# Altium project Arduino_Nano.PrjPcb
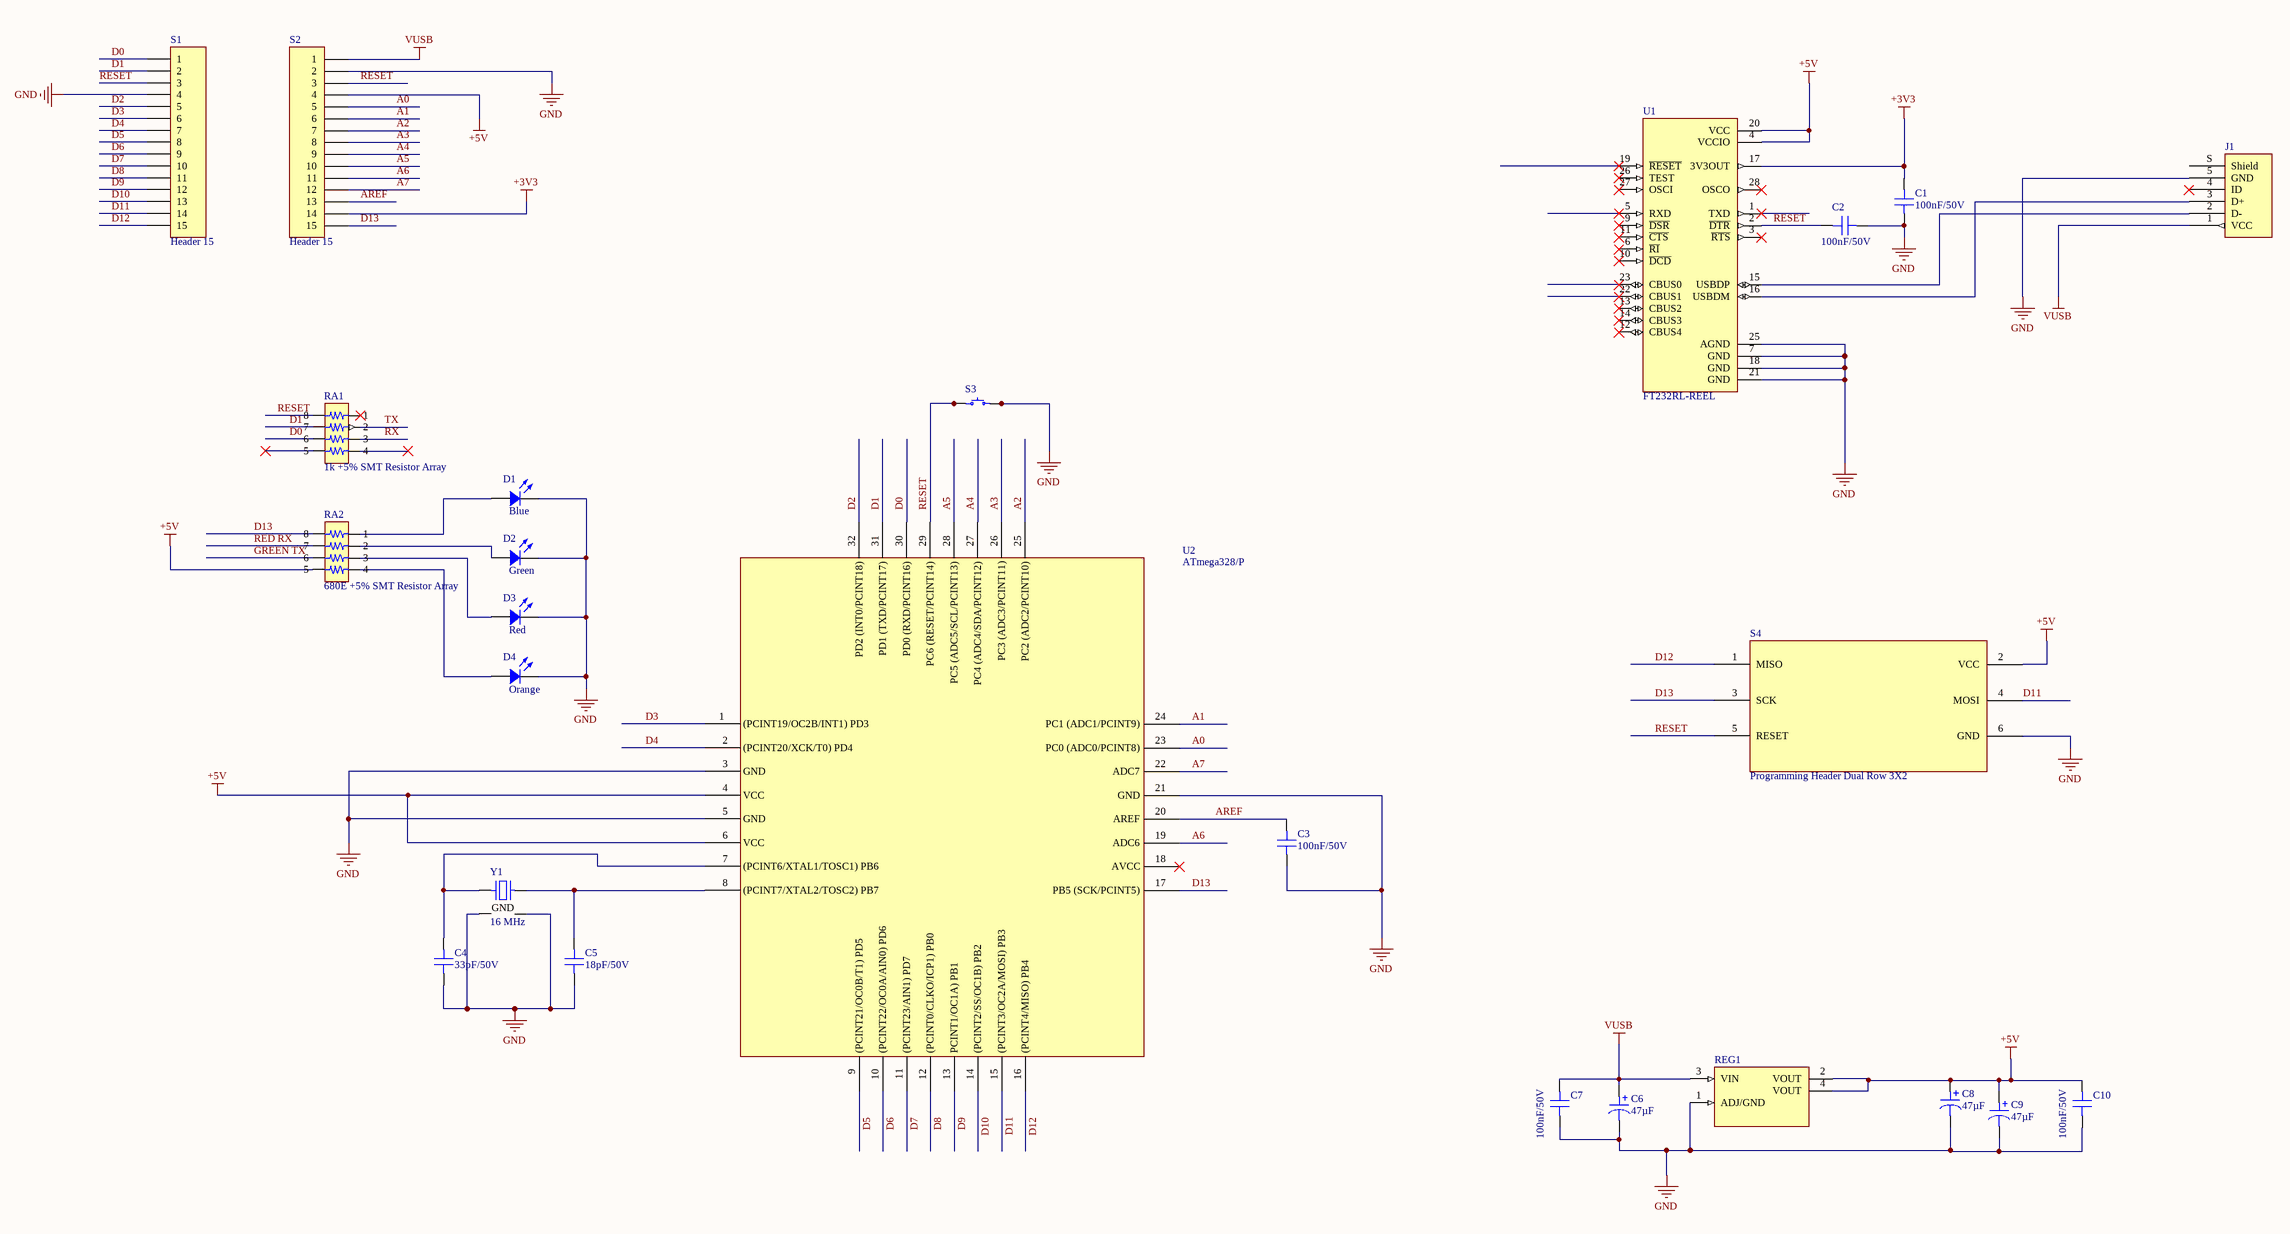
[diagram p0: Sheet1.SchDoc]
1 sheet, 25 parts. Net scope: global (net labels, ports and power ports of the same name join across sheets).
Board file: PCB3.PcbDoc

## Sheet Sheet1.SchDoc
size A2; SheetNumber: 1; SheetTotal: 1

### Parts
C1  100nF/50V  [CAP 0805_2012]
C2  100nF/50V  [CAP 0805_2012]
C3  100nF/50V  [CAP 0805_2012]
C4  33pF/50V  [CAP 0805_2012]
C5  18pF/50V  [CAP 0805_2012]
C6  47µF  [CAP ALSMD 8.3MM H10.5MM]
C7  100nF/50V  [CAP 0805_2012]
C8  47µF  [CAP ALSMD 8.3MM H10.5MM]
C9  47µF  [CAP ALSMD 8.3MM H10.5MM]
C10  100nF/50V  [CAP 0805_2012]
D1  Blue  [LED 1206_3216 BLUE]
D2  Green  [LED 1206_3216 GREEN]
D3  Red  [LED 1206_3216 RED]
D4  Orange  [LED 1206_3216 RED]
J1  10118193-0001LF  [FCI USB 10118193-0001LF]  (value not drawn)
RA1  1k +5% SMT Resistor Array  [RESNET 1206-8 CONCAVE]
RA2  680E +5% SMT Resistor Array  [RESNET 1206-8 CONVEX]
REG1  LM1117IMPX-5.0  [SOT230P700X180-4N]  (value not drawn)
S1  Header 15  [HDR1X15]
S2  Header 15  [HDR1X15]
S3  PTS810 SJM 250 SMTR LFS  [C&K PTS810]  (value not drawn)
S4  Programming Header Dual Row 3X2  [Header 3X2]
U1  FT232RL-REEL  [SOP65P780X200-28N]
U2  ATmega328/P  [TQFP80P900X900X120-32N]
Y1  16 MHz  [NDK NX2520SA]

### Nets
+3V3: C1.2 S2.14 U1.17(3V3OUT)
+5V: C8.1 C9.1 C10.1 RA2.4 REG1.2(VOUT) REG1.4(VOUT) S2.4 S4.2(VCC) U1.4(VCCIO) U1.20(VCC) U2.4(VCC) U2.6(VCC)
GND: C1.1 C2.2 C3.1 C4.1 C5.1 C6.2 C7.2 C8.2 C9.2 C10.2 D1.2 D2.2 D3.2 D4.2 J1.5(GND) REG1.1(ADJ/GND) S1.4 S2.2 S3.3 S3.4 S4.6(GND) U1.7(GND) U1.18(GND) U1.21(GND) U1.25(AGND) U2.3(GND) U2.5(GND) U2.21(GND) Y1.2(GND) Y1.4(GND)
VUSB: C6.1 C7.1 J1.1(VCC) REG1.3(VIN) S2.1
A0: S2.5 U2.23(PC0_(ADC0/PCINT8))
A1: S2.6 U2.24(PC1_(ADC1/PCINT9))
A2: S2.7 U2.25(PC2_(ADC2/PCINT10))
A3: S2.8 U2.26(PC3_(ADC3/PCINT11))
A4: S2.9 U2.27(PC4_(ADC4/SDA/PCINT12))
A5: S2.10 U2.28(PC5_(ADC5/SCL/PCINT13))
A6: S2.11 U2.19(ADC6)
A7: S2.12 U2.22(ADC7)
AREF: C3.2 S2.13 U2.20(AREF)
D0: RA1.3 S1.1 U2.30(PD0_(RXD/PCINT16))
D1: RA1.2 S1.2 U2.31(PD1_(TXD/PCINT17))
D2: S1.5 U2.32(PD2_(INT0/PCINT18))
D3: S1.6 U2.1((PCINT19/OC2B/INT1)_PD3)
D4: S1.7 U2.2((PCINT20/XCK/T0)_PD4)
D5: S1.8 U2.9((PCINT21/OC0B/T1)_PD5)
D6: S1.9 U2.10((PCINT22/OC0A/AIN0)_PD6)
D7: S1.10 U2.11((PCINT23/AIN1)_PD7)
D8: S1.11 U2.12((PCINT0/CLKO/ICP1)_PB0)
D9: S1.12 U2.13(PCINT1/OC1A)_PB1)
D10: S1.13 U2.14((PCINT2/SS/OC1B)_PB2)
D11: S1.14 S4.4(MOSI) U2.15((PCINT3/OC2A/MOSI)_PB3)
D12: S1.15 S4.1(MISO) U2.16((PCINT4/MISO)_PB4)
D13: RA2.1 S2.15 S4.3(SCK) U2.17(PB5_(SCK/PCINT5))
GREEN TX: RA2.3
RED RX: RA2.2
RESET: C2.1 RA1.1 S1.3 S2.3 S3.1 S3.2 S4.5(RESET) U1.2(~{DTR}) U2.29(PC6_(RESET/PCINT14))
RX: RA1.6
TX: RA1.7
NetC4_2: C4.2 U2.7((PCINT6/XTAL1/TOSC1)_PB6) Y1.1
NetC5_2: C5.2 U2.8((PCINT7/XTAL2/TOSC2)_PB7) Y1.3
NetD1_1: D1.1 RA2.8
NetD2_1: D2.1 RA2.7
NetD3_1: D3.1 RA2.6
NetD4_1: D4.1 RA2.5
NetJ1_2: J1.2(D-) U1.15(USBDP)
NetJ1_3: J1.3(D+) U1.16(USBDM)

Not connected (* = marked no-connect by the designer): J1 4(ID)* S(Shield); RA1 4* 5* ?1(8)*; U1 1(TXD)* 3(~{RTS})* 5(RXD)* 6(~{RI})* 9(~{DSR})* 10(~{DCD})* 11(~{CTS})* 12(CBUS4)* 13(CBUS2)* 14(CBUS3)* 19(~{RESET})* 22(CBUS1)* 23(CBUS0)* 26(TEST)* 27(OSCI)* 28(OSCO)*; U2 18(AVCC)*

### Library data of the parts
C1-C3 C7 C10 = 08055D104KAT2A: CAP CER 0.1UF 50V X5R 0805; manufacturer: AVX Corporation; Tolerance: ±10%; value: 0.1µF; Part Number: 08055D104KAT2A; Applications: General Purpose; componentlink1description: Datasheet; componentlink1url: http://datasheets.avx.com/cx5r.pdf; componentlink2description: DigiKey Link; componentlink2url: http://digikey.com/product-detail/en/avx-corporation/08055D104KAT2A/478-12790-1-ND/9949330; Device Package: 0805 (2012 Metric); lastupdated: 2/9/2020 1:04:29 am; Lifecycle Status: Active; Minimum Order: 1; Mounting Type: Surface Mount, MLCC; Operating Temperature: -55°C ~ 85°C; Package / Case: 0805 (2012 Metric); packaging: TapeAndReel; partid: 9440; Part Status: Active; price: 0.02; series: -; Size / Dimension: 0.079" L x 0.049" W (2.01mm x 1.25mm); Supplier 1: DigiKey; Supplier Part Number 1: 478-12790-1-ND; Temperature Coefficient: X5R; Thickness (Max): 0.055" (1.40mm); Voltage - Rated: 50V
C4 C5 = 08055A180JAT2A: CAP CER 18PF 50V C0G/NP0 0805; manufacturer: AVX Corporation; Temperature Coefficient: C0G, NP0; Tolerance: ±5%; Part Number: 08055A180JAT2A; Applications: General Purpose; componentlink1description: Datasheet; componentlink1url: http://datasheets.avx.com/C0GNP0-Dielectric.pdf; componentlink2description: DigiKey Link; componentlink2url: http://digikey.com/product-detail/en/avx-corporation/08055A180JAT2A/478-1307-1-ND/564339; Device Package: 0805 (2012 Metric); lastupdated: 2/9/2020 1:04:40 am; Lifecycle Status: Active; Minimum Order: 1; Mounting Type: Surface Mount, MLCC; Operating Temperature: -55°C ~ 125°C; Package / Case: 0805 (2012 Metric); packaging: TapeAndReel; partid: 3219; Part Status: Active; price: 0.02; series: -; Size / Dimension: 0.079" L x 0.049" W (2.01mm x 1.25mm); Supplier 1: DigiKey; Supplier Part Number 1: 478-1307-1-ND; Thickness (Max): 0.037" (0.94mm); value: 18pF; Voltage - Rated: 50V
C6 = UUR1J470MNL1GS: CAP ALUM 47UF 20% 63V SMD; manufacturer: Nichicon; Lifetime @ Temp.: 2000 Hrs @ 85°C; Ripple Current @ High Frequency: 233.8mA @ 10kHz; Ripple Current @ Low Frequency: 140mA @ 120Hz; Surface Mount Land Size: 0.327" L x 0.327" W (8.30mm x 8.30mm); Part Number: UUR1J470MNL1GS; Applications: General Purpose; Capacitance: 47µF; componentlink1description: Datasheet; componentlink1url: http://nichicon-us.com/english/products/pdfs/e-uur.pdf; componentlink2description: DigiKey Link; componentlink2url: http://digikey.com/product-detail/en/nichicon/UUR1J470MNL1GS/493-6235-1-ND/3438748; Device Package: Radial, Can - SMD; Height - Seated (Max): 0.413" (10.50mm); lastupdated: 2/9/2020 1:25:15 am; Lifecycle Status: Active; Minimum Order: 1; Mounting Type: Surface Mount; Operating Temperature: -40°C ~ 85°C; Package / Case: Radial, Can - SMD; packaging: TapeAndReel; partid: 7532; Part Status: Active; price: 0.17; series: UUR; Size / Dimension: 0.315" Dia (8.00mm); Supplier 1: DigiKey; Supplier Part Number 1: 493-6235-1-ND; Tolerance: ±20%; value: 47µF; Voltage - Rated: 63V
C8 C9 = 35THV47M8X10.5: CAP ALUM 47UF 20% 35V SMD; manufacturer: Rubycon; ESR (Equivalent Series Resistance): 300mOhm @ 100kHz; Lifetime @ Temp.: 3000 Hrs @ 125°C; Polarization: Polar; Ripple Current @ High Frequency: 300mA @ 100kHz; Ripple Current @ Low Frequency: 150mA @ 120Hz; Surface Mount Land Size: 0.327" L x 0.327" W (8.30mm x 8.30mm); Part Number: 35THV47M8X10.5; Applications: Automotive; Capacitance: 47µF; componentlink1description: Datasheet; componentlink1url: http://www.rubycon.co.jp/en/catalog/e_pdfs/aluminum/e_THV.pdf; componentlink2description: DigiKey Link; componentlink2url: http://digikey.com/product-detail/en/rubycon/35THV47M8X10.5/1189-2054-1-ND/3986973; Device Package: Radial, Can - SMD; Height - Seated (Max): 0.413" (10.50mm); lastupdated: 2/9/2020 1:25:15 am; Lifecycle Status: Active; Minimum Order: 1; Mounting Type: Surface Mount; Operating Temperature: -40°C ~ 125°C; Package / Case: Radial, Can - SMD; packaging: TapeAndReel; partid: 7520; Part Status: Active; price: 0.27; Ratings: AEC-Q200; series: THV; Size / Dimension: 0.315" Dia (8.00mm); Supplier 1: DigiKey; Supplier Part Number 1: 1189-2054-1-ND; Tolerance: ±20%; value: 47µF; Voltage - Rated: 35V
D1 = APT3216QBC/D: LED BLUE CLEAR CHIP SMD; Manufacturer: Kingbright; Configuration: Standard; Current - Test: 20mA; Lens Color: Colorless; Lens Size: 2.00mm x 1.60mm; Lens Style: Rectangle with Flat Top; Millicandela Rating: 100mcd; Viewing Angle: 120°; Voltage - Forward (Vf) (Typ): 3.3V; Wavelength - Dominant: 465nm; Wavelength - Peak: 460nm; Part Number: APT3216QBC/D; Color: Blue; ComponentLink1Description: Datasheet; ComponentLink1URL: http://www.kingbrightusa.com/images/catalog/SPEC/APT3216QBC-D.pdf; ComponentLink2Description: DigiKey Link; ComponentLink2URL: https://www.digikey.com/en/products/detail/kingbright/APT3216QBC-D/2163702; Device Package: 1206 (3216 Metric); Height (Max): 0.75mm; LastUpdated: 3/6/2024 7:58:07 pm; Lens Transparency: Clear; Lifecycle Status: Active; Minimum Order: 1; Mounting Type: Surface Mount; Package / Case: 1206 (3216 Metric); Packaging: TapeAndReel; PartId: 730; Part Status: Active; Price: 0.09; Series: -; Size / Dimension: 3.20mm L x 1.60mm W; Supplier 1: DigiKey; Supplier Part Number 1: 754-1439-1-ND; Supplier Device Package: Chip LED; Value: Blue
D2 = 5976325607F: LED GREEN 1206 SMD; Manufacturer: Dialight; Configuration: Standard; Current - Test: 20mA; Lens Color: 1.23mm; Lens Size: 1.60mm Dia; Lens Style: Round with Domed Top; Viewing Angle: 70°; Voltage - Forward (Vf) (Typ): 3.3V; Wavelength - Peak: 530nm; Part Number: 5976325607F; Color: Green; ComponentLink1Description: Datasheet; ComponentLink1URL: //media.digikey.com/pdf/Data%20Sheets/Dialight%20PDFs/5976325607F.pdf; ComponentLink2Description: DigiKey Link; ComponentLink2URL: http://digikey.com/product-detail/en/dialight/5976325607F/350-4393-1-ND/9385499; Device Package: 1206 (3216 Metric); Height (Max): 1.23mm; LastUpdated: 2/9/2020 1:20:47 am; Lifecycle Status: Active; Minimum Order: 1; Mounting Type: Surface Mount; Package / Case: 1206 (3216 Metric); Packaging: TapeAndReel; PartId: 533; Part Status: Active; Price: 0.28; Series: 597; Size / Dimension: 3.20mm L x 1.60mm W; Supplier 1: DigiKey; Supplier Part Number 1: 350-4393-1-ND; Supplier Device Package: 1206; Value: Green
D3 D4 = 5990210007F: LED RED 1206 SMD; Manufacturer: Dialight; Configuration: Standard; Current - Test: 20mA; Lens Color: 0.80mm; Lens Size: 2.00mm x 1.60mm; Lens Style: Rectangle with Flat Top; Millicandela Rating: 29mcd; Viewing Angle: 140°; Voltage - Forward (Vf) (Typ): 2.1V; Wavelength - Dominant: 633nm; Part Number: 5990210007F; Color: Red; ComponentLink1Description: Datasheet; ComponentLink1URL: http://www.dialightsignalsandcomponents.com/Assets/Brochures_And_Catalogs/Indication/CBI_SMD_new/Dialight_CBI_data_599-1206_Apr2018.pdf; ComponentLink2Description: DigiKey Link; ComponentLink2URL: https://www.digikey.com/en/products/detail/dialight/5990210007F/9385415; Device Package: 1206 (3216 Metric); Height (Max): 0.80mm; LastUpdated: 3/6/2024 8:00:41 pm; Lifecycle Status: Active; Minimum Order: 1; Mounting Type: Surface Mount; Package / Case: 1206 (3216 Metric); Packaging: TapeAndReel; PartId: 188; Part Status: Active; Price: 0.04; Series: 599; Size / Dimension: 3.20mm L x 1.60mm W; Supplier 1: DigiKey; Supplier Part Number 1: 350-4360-1-ND; Supplier Device Package: 1206; Value: Red
J1 = 10118193-0001LF: CONN RCPT USB2.0 MICRO B SMD R/A; Manufacturer: Amphenol ICC (FCI); Connector Type: USB - micro B; Current Rating (Amps): 1.8A per Contact; Gender: Receptacle; Mating Cycles: 10000; Number of Contacts: 5; Number of Ports: 1; Shielding: Shielded; Voltage - Rated: 100VAC; Part Number: 10118193-0001LF; ComponentLink1Description: Datasheet; ComponentLink1URL: https://cdn.amphenol-icc.com/media/wysiwyg/files/documentation/datasheet/inputoutput/io_usb_micro.pdf; ComponentLink2Description: DigiKey Link; ComponentLink2URL: //digikey.com/product-detail/en/amphenol-icc-fci/10118193-0001LF/609-4616-2-ND/2785388; Features: Solder Retention; LastUpdated: 9/12/2019 8:51:28 pm; Lifecycle Status: 0; Minimum Order: 1; Mounting Feature: Horizontal; Mounting Type: Surface Mount, Right Angle; Through Hole; Operating Temperature: -30°C ~ 80°C; Packaging: TapeAndReel; Part Status: Active; Price: 0.21; Series: -; Specifications: USB 2.0; Supplier 1: DigiKey; Supplier Part Number 1: 609-4616-2-ND; Termination: Solder
RA1 = TC164-JR-071KL: RES ARRAY 4 RES 1K OHM 1206; Manufacturer: Yageo; Circuit Type: Isolated; Number of Resistors: 4; Power Per Element: 62.5mW; Temperature Coefficient: ±200ppm/°C; Tolerance: ±5%; Part Number: TC164-JR-071KL; Applications: DDRAM, SDRAM; ComponentLink1Description: Datasheet; ComponentLink1URL: https://www.yageo.com/upload/media/product/productsearch/datasheet/rchip/PYu-YC_TC_group_51_RoHS_L_9.pdf; ComponentLink2Description: DigiKey Link; ComponentLink2URL: http://digikey.com/product-detail/en/yageo/TC164-JR-071KL/TC164J-1.0KCT-ND/1005384; Height - Seated (Max): 0.028" (0.70mm); LastUpdated: 2/9/2020 1:23:31 am; Lifecycle Status: Active; Minimum Order: 1; Mounting Type: Surface Mount; Number of Pins: 8; Operating Temperature: -55°C ~ 155°C; Package / Case: 1206 (3216 Metric), Concave, Long Side Terminals; Packaging: TapeAndReel; PartId: 880; Part Status: Active; Price: 0.02; Resistance (Ohms): 1k; Series: TC164; Size / Dimension: 0.126" L x 0.063" W (3.20mm x 1.60mm); Supplier 1: DigiKey; Supplier Part Number 1: TC164J-1.0KCT-ND
RA2 = YC164-JR-07680RL: RES ARRAY 4 RES 680 OHM 1206; Manufacturer: Yageo; Circuit Type: Isolated; Number of Resistors: 4; Power Per Element: 62.5mW; Resistance (Ohms): 680; Temperature Coefficient: ±200ppm/°C; Tolerance: ±5%; Part Number: YC164-JR-07680RL; Applications: DDRAM, SDRAM; ComponentLink1Description: Datasheet; ComponentLink1URL: https://www.yageo.com/upload/media/product/productsearch/datasheet/rchip/PYu-YC_TC_group_51_RoHS_L_9.pdf; ComponentLink2Description: DigiKey Link; ComponentLink2URL: http://digikey.com/product-detail/en/yageo/YC164-JR-07680RL/YC164J-680CT-ND/1005675; Height - Seated (Max): 0.028" (0.70mm); LastUpdated: 24/3/2022 2:30:41 pm; Lifecycle Status: Active; Minimum Order: 1; Mounting Type: Surface Mount; Number of Pins: 8; Operating Temperature: -55°C ~ 155°C; Package / Case: 1206 (3216 Metric), Convex, Long Side Terminals; Packaging: TapeAndReel; PartId: 246; Part Status: Active; Price: 0.01; Series: YC164; Size / Dimension: 0.126" L x 0.063" W (3.20mm x 1.60mm); Supplier 1: DigiKey; Supplier Part Number 1: YC164J-680CT-ND
REG1 = LM1117IMPX-5.0: 800-mA/5V Linear Voltage Regulator; MF: Texas Instruments; MP: LM1117IMPX-5.0/NOPB; SnapEDA_Link: https://www.snapeda.com/parts/LM1117IMPX-5.0/NOPB/Texas+Instruments/view-part/?ref=snap; Package: SOT-223-4 Texas Instruments; Value: *; Check_prices: https://www.snapeda.com/parts/LM1117IMPX-5.0/NOPB/Texas+Instruments/view-part/?ref=eda
S1 S2 = Header 15: Header, 15-Pin; LatestRevisionDate: 17-Jul-2002; LatestRevisionNote: Re-released for DXP Platform.; Publisher: Altium Limited
S3 = PTS810 SJM 250 SMTR LFS: SWITCH TACTILE SPST-NO 0.05A 16V; Manufacturer: C&K; Actuator Height off PCB, Vertical: 2.50mm; Actuator Orientation: Top Actuated; Actuator Type: Oval Button; Contact Rating @ Voltage: 0.05A @ 16VDC; Illumination: Non-Illuminated; Operating Force: 160gf; Outline: 4.20mm x 3.20mm; Switch Function: Off-Mom; Part Number: PTS810 SJM 250 SMTR LFS; Circuit: SPST-NO; ComponentLink1Description: Datasheet; ComponentLink1URL: https://dznh3ojzb2azq.cloudfront.net/products/Tactile/PTS810/documents/datasheet.pdf; ComponentLink2Description: DigiKey Link; ComponentLink2URL: http://digikey.com/product-detail/en/c-k/PTS810-SJM-250-SMTR-LFS/CKN10502CT-ND/4176673; LastUpdated: 9/4/2020 10:00:13 am; Lifecycle Status: Active; Minimum Order: 1; Mounting Type: Surface Mount; Operating Temperature: -40°C ~ 85°C; Packaging: TapeAndReel; Part Status: Active; Price: 0.16; Series: PTS810; Supplier 1: DigiKey; Supplier Part Number 1: CKN10502CT-ND; Termination Style: J Lead
S4 = Header 3X2
U1 = FT232RL-REEL: USB Bridge, USB to UART USB 2.0 UART Interface 28-SSOP; MF: FTDI,; Check_prices: https://www.snapeda.com/parts/FT232RL-REEL/FTDI%252C+Future+Technology+Devices+International+Ltd/view-part/?ref=eda; Purchase-URL: https://pricing.snapeda.com/search/part/FT232RL-REEL/?ref=eda; Price: None; SnapEDA_Link: https://www.snapeda.com/parts/FT232RL-REEL/FTDI%252C+Future+Technology+Devices+International+Ltd/view-part/?ref=snap; Availability: In Stock; Package: SSOP-28 FTDI; MP: FT232RL-REEL; Value: *
Y1 = NX2520SA-16.000000MHZ-W1: CRYSTAL 16.0000MHZ 8PF SMD; Manufacturer: NDK America, Inc.; ESR (Equivalent Series Resistance): 120 Ohms; Frequency Stability: ±20ppm; Operating Mode: Fundamental; Part Number: NX2520SA-16.000000MHZ-W1; ComponentLink1Description: Datasheet; ComponentLink1URL: //media.digikey.com/pdf/Data Sheets/NDK PDFs/NX2520SA-16.000000MHz-W1.pdf; ComponentLink2Description: DigiKey Link; ComponentLink2URL: https://www.digikey.com/en/products/detail/ndk-america-inc/NX2520SA-16-000000MHZ-W1/1468334; Frequency: 16 MHz; Frequency Tolerance: ±20ppm; Height - Seated (Max): 0.026" (0.65mm); LastUpdated: 3/6/2024 8:02:18 pm; Lifecycle Status: Active; Load Capacitance: 8pF; Minimum Order: 1; Mounting Type: Surface Mount; Operating Temperature: -40°C ~ 85°C; Package / Case: 4-SMD, No Lead; Packaging: TapeAndReel; PartId: 523; Part Status: Active; Price: 0.77; Series: NX2520SA; Size / Dimension: 0.098" L x 0.079" W (2.50mm x 2.00mm); Supplier 1: DigiKey; Supplier Part Number 1: 644-1093-1-ND; Type: MHz Crystal; Value: 16 MHz
U2 = ATmega328/P: ComponentLink1Description: Datasheet; ComponentLink1URL: https://datasheet.octopart.com/ATMEGA328-AU-Microchip-datasheet-65729177.pdf